# Altium schematic sheet DS18B20.SchDoc
size A4
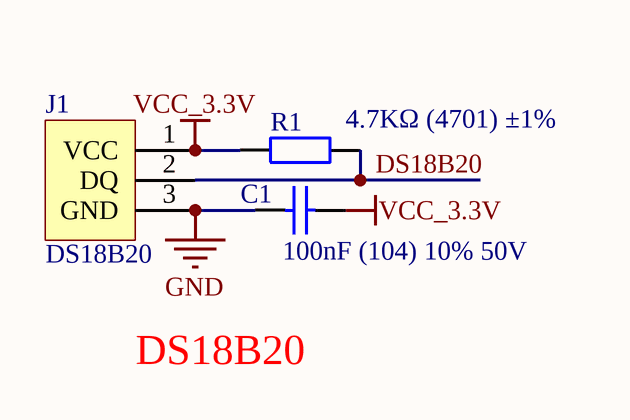
[diagram p0: DS18B20.SchDoc]

## Parts
C1  100nF (104) 10% 50V  [CAPC_0603_2]
J1  DS18B20  [XH_2.54_3P]
R1  4.7KΩ (4701) ±1%  [RESC_0603_2]

## Nets
GND: C1.1 J1.3(GND)
VCC_3.3V: C1.2 J1.1(VCC) R1.1
DS18B20: J1.2(DQ) R1.2

## Notes on the sheet
- DS18B20

## Library data of the parts
C1 = 0603 100nF (104) 10% 50V: 贴片电容; ComponentLink1Description: 供应商链接; ComponentLink1URL: http://www.szlcsc.com/product/details_15331.html; Package: 0603; Supplier: LC; SuppliersPartNumber: C14663
J1 = Component_1_3
R1 = 0603 4.7KΩ (4701) 1%: 贴片电阻; ComponentLink1Description: 供应商链接; ComponentLink1URL: http://www.szlcsc.com/product/details_23889.html; Package: 0603; Supplier: LC; SuppliersPartNumber: C23162